# Altium project ONLY_power_board.PrjPcb
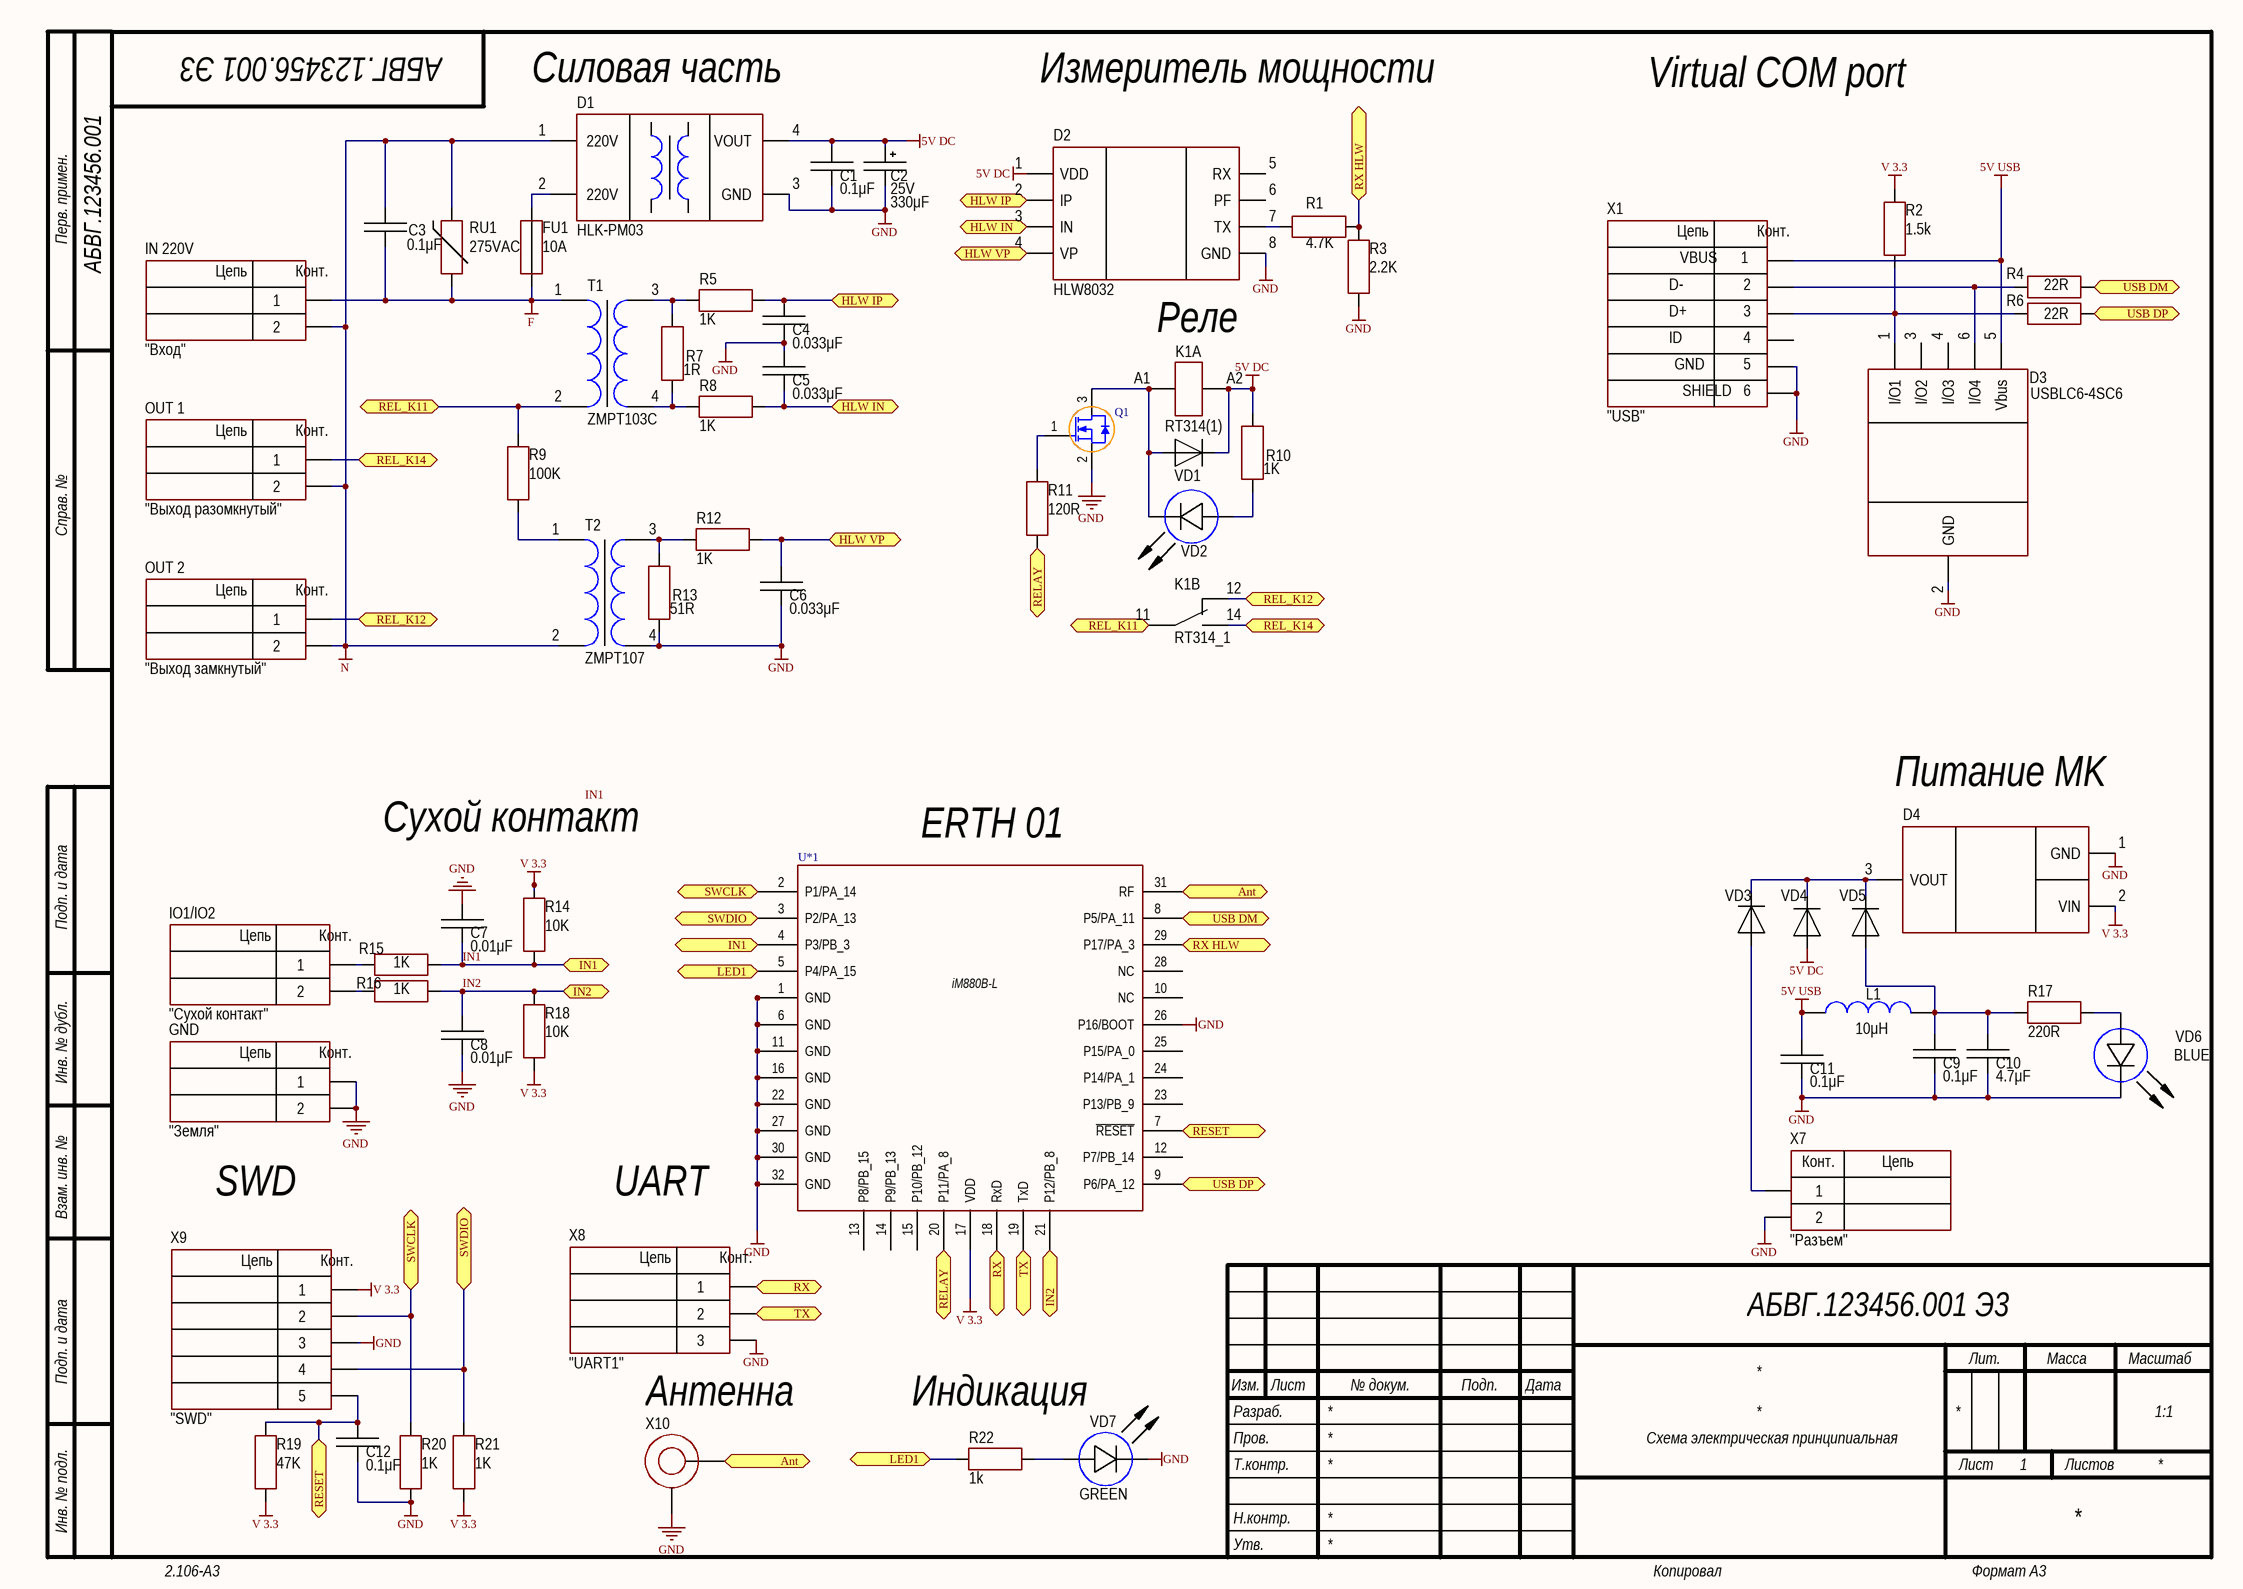
[diagram p0: Power1.SchDoc]
1 sheet, 63 parts. Net scope: flat (ports and power ports of the same name join across sheets).
Board file: Power.PcbDoc

## Sheet Power1.SchDoc
size 420 x 297 mm; Address1: Address1; Address2: Address2; Address3: Address3; Address4: Address4; DocumentNumber: АБВГ.123456.001 Э3; SheetNumber: 1; Scale: 1:1; DocumentType: Схема электрическая принципиальная; FirstReferrence: АБВГ.123456.001

### Parts
C1  value 0.1μF  [CAP: 0805]
C2  value 330μF  Voltage: 25V  [CAP: D13C5H25]
C3  value 0.1μF  [CAP: B32521]  (hidden comment: 400V)
C4  value 0.033μF  [CAP: 0805]
C5  value 0.033μF  [CAP: 0805]
C6  value 0.033μF  [CAP: 0805]
C7  value 0.01μF  [CAP: 0805]
C8  value 0.01μF  [CAP: 0805]
C9  value 0.1μF  [CAP: 0805]
C10  value 4.7μF  [CAP: 0805]
C11  value 0.1μF  [CAP: 0805]
C12  value 0.1μF  [CAP: 0805]
D1  (no value)  [MOD: HLK-PM01]
D2  (no value)  [8-SOP-8_1_27]
D3  PartNumber: USBLC6-4SC6  [SOT23-6]
D4  (no value)  [SOT23-5]
FU1  MaxCurrent: 10A  [FUSE: FH-100 (5x20 mm)]
GND  CommentText: "Земля"  [393570002]
IN_220V  CommentText: "Вход"  [393570002]
IO1/IO2  CommentText: "Сухой контакт"  [393570002]
K1  PartNumber: RT314(1)  [REL: RT314005]  (parts A,B of 3)
L1  value 10μH  [IND: 0805]
OUT_1  CommentText: "Выход разомкнутый"  [393570002]
OUT_2  CommentText: "Выход замкнутый"  [393570002]
Q1  TRPBF  [SOT23_N+]  (value not drawn)
R1  value 4.7K  [RES: 0805]
R2  value 1.5k  [RES: 0805]
R3  value 2.2K  [RES: 0805]
R4  value 22R  [RES: 0805]
R5  value 1K  [RES: 0805]
R6  value 22R  [RES: 0805]
R7  value 1R  [RES: 0805]
R8  value 1K  [RES: 0805]
R9  value 100K  [RES: 1206]
R10  value 1K  [RES: 0805]
R11  value 120R  [RES: 0805]
R12  value 1K  [RES: 0805]
R13  value 51R  [RES: 0805]
R14  value 10K  [RES: 0805]
R15  value 1K  [RES: 0805]
R16  value 1K  [RES: 0805]
R17  value 220R  [RES: 0805]
R18  value 10K  [RES: 0805]
R19  value 47K  [RES: 0805]
R20  value 1K  [RES: 0805]
R21  value 1K  [RES: 0805]
R22  value 1k  [RES: 0805]
RU1  MaxVoltage: 275VAC  [CAP: B32521]
T1  Voltage: ZMPT103C  [TRANS:ZMCT103C]
T2  Voltage: ZMPT107  [TRANS:ZMPT107-1]
U*1  iM880B-L  [iM880B]
VD1  C2128  [DIODE: SOD123F]  (value not drawn)
VD2  (no value)  [LED: 0805R]
VD3  C2128  [DIODE: SOD123F]  (value not drawn)
VD4  C2128  [DIODE: SOD123F]  (value not drawn)
VD5  C2128  [DIODE: SOD123F]  (value not drawn)
VD6  Color: BLUE  [LED: 0805B]
VD7  Color: GREEN  [LED: 0805G]
X1  CommentText: "USB"  [CON: USB micro-A (ZX62-B-5PA)]
X7  CommentText: "Разъем"  [CON: B2B-EH-A]
X8  CommentText: "UART1"  [CON: PLS-3]
X9  CommentText: "SWD"  [CON: PLS-5]
X10  (no value)  [CON: u.Fl]

### Ports
Ant, HLW IN, HLW IP, HLW VP, IN1, IN2, LED1, REL_K11, REL_K12, REL_K14, RELAY, RESET, RX, RX HLW, SWCLK, SWDIO, TX, USB DM, USB DP

### Nets
5V DC: C1.2 C2.1 D1.4(VOUT) D2.1(VDD) K1.A2 R10.2 VD1.2 VD4.1
5V USB: C11.2 D3.5(Vbus) L1.2 X1.1
F: C3.1 FU1.1 IN_220V.1 RU1.1 T1.1
GND: C1.1 C2.2 C4.1 C5.2 C6.1 C7.2 C8.1 C9.1 C10.1 C11.1 C12.1 D1.3(GND) D2.8(GND) D3.2(GND) D4.1(GND) GND.1 GND.2 Q1.2(S) R3.2 R13.1 R20.2 T2.4 U*1.1(GND) U*1.6(GND) U*1.11(GND) U*1.16(GND) U*1.22(GND) U*1.26(P16/BOOT) U*1.27(GND) U*1.30(GND) U*1.32(GND) VD6.2(C) VD7.2(C) X1.0 X1.5 X7.2 X8.3 X9.3 X10.2
N: C3.2 D1.1(220V) IN_220V.2 OUT_1.2 OUT_2.2 RU1.2 T2.2
V 3.3: D4.2(VIN) R2.2 R14.1 R18.1 R19.2 R21.2 U*1.17(VDD) X9.1
IN1: C7.1 R14.2 R15.1 U*1.4(P3/PB_3) ; port IN1
IN2: C8.2 R16.1 R18.2 U*1.21(P12/PB_8) ; port IN2
NetC4_2: C4.2 D2.2(IP) R5.1 ; port HLW IP
NetC5_1: C5.1 D2.3(IN) R8.1 ; port HLW IN
NetC6_2: C6.2 D2.4(VP) R12.1 ; port HLW VP
NetC9_2: C9.2 C10.2 L1.1 R17.2 VD5.1
NetC12_2: C12.2 R19.1 U*1.7(~{RESET}) X9.5 ; port RESET
NetD1_2: D1.2(220V) FU1.2
NetD2_7: D2.7(TX) R1.1
NetD3_1: D3.1(I/O1) R2.1 R6.1 X1.3
NetD3_6: D3.6(I/O4) R4.1 X1.2
NetD4_3: D4.3(VOUT) VD3.2 VD4.2 VD5.2
NetIO1/IO2_1: IO1/IO2.1 R15.2
NetIO1/IO2_2: IO1/IO2.2 R16.2
NetK1_11: K1.11 R9.2 T1.2 ; port REL_K11
NetK1_12: K1.12 OUT_2.1 ; port REL_K12
NetK1_14: K1.14 OUT_1.1 ; port REL_K14
NetK1_A1: K1.A1 Q1.3(D) VD1.1 VD2.2(C)
NetQ1_1: Q1.1(G) R11.1
NetR1_2: R1.2 R3.1 U*1.29(P17/PA_3) ; port RX HLW
NetR4_2: R4.2 U*1.8(P5/PA_11) ; port USB DM
NetR5_2: R5.2 R7.2 T1.3
NetR6_2: R6.2 U*1.9(P6/PA_12) ; port USB DP
NetR7_1: R7.1 R8.2 T1.4
NetR9_1: R9.1 T2.1
NetR10_1: R10.1 VD2.1(A)
NetR11_2: R11.2 U*1.20(P11/PA_8) ; port RELAY
NetR12_2: R12.2 R13.2 T2.3
NetR17_1: R17.1 VD6.1(A)
NetR20_1: R20.1 U*1.2(P1/PA_14) X9.2 ; port SWCLK
NetR21_1: R21.1 U*1.3(P2/PA_13) X9.4 ; port SWDIO
NetR22_1: R22.1 VD7.1(A)
NetR22_2: R22.2 U*1.5(P4/PA_15) ; port LED1
NetU*1_18: U*1.18(RxD) X8.1 ; port RX
NetU*1_19: U*1.19(TxD) X8.2 ; port TX
NetU*1_31: U*1.31(RF) X10.1 ; port Ant
NetVD3_1: VD3.1 X7.1

Not connected (* = marked no-connect by the designer): D2 5(RX) 6(PF); D3 3(I/O2) 4(I/O3); U*1 10(NC) 12(P7/PB_14) 13(P8/PB_15) 14(P9/PB_13) 15(P10/PB_12) 23(P13/PB_9) 24(P14/PA_1) 25(P15/PA_0) 28(NC); X1 4

### Notes on the sheet
- Силовая часть
- Измеритель мощности
- Virtual COM port
- Реле
- Питание MK
- Cухой контакт
- (near U*1) ERTH 01
- SWD
- UART
- Антенна
- Индикация
- Labels drawn without touching a wire or pin: IN1
- Перв. примен.
- Справ. №
- Подп. и дата
- Инв. № дубл.
- Взам. инв. №
- Разраб.
- Изм.
- Лист
- № докум.
- Подп.
- Дата
- Лит.
- Масса
- Масштаб
- Пров.
- Т.контр.
- Листов
- Инв. № подл.
- Утв.
- Н.контр.
- 2.106-A3
- Копировал
- Формат А3
- (in symbol Connector-Wago 734-102/037-000) Цепь; Конт.
- (in symbol Connector_B2B-EH-A) Конт.; Цепь
- (in symbol Connector_USB_micro_B) Цепь; Конт.; VBUS; D-; D+; ID; GND; SHIELD; 6
- (in symbol PLS-3) Цепь; Конт.
- (in symbol PLS-5) Цепь; Конт.

### Library data of the parts
C1 C3 C9 C11 C12 = Ceramic_0805: Manufacturer: Yageo; PartNumber: C49678; TypeCapacitor: Ceramic capacitor; Tolerance: ±10%; TypeDielectric: X7R; HelpURL: https://www.digikey.com/product-detail/en/yageo/CC0805KRX7R7BB104/311-1142-1-ND/303052; ValueManufacturerPartNumber: =TypeCapacitor+', '+Value+', '+TypeDielectric+', '+Tolerance+', '+Voltage+', '+Package+', '+Temperature; Temperature: -55...+125°C
  C1 C9 C11 C12: Package: 0805
  C3: Package: DIP
C2 = Aluminium: Manufacturer: Wurth; PartNumber: 860080475013; ValueManufacturerPartNumber: Aluminium capacitor, 330μF, 25V, ±20%, 54mOhm, 14x10x5 mm, -55...+105°C; TypeCapacitor: Aluminium capacitor; Tolerance: ±20%; Impedance: 54mOhm; Package: 14x10x5 mm; HelpURL: https://www.digikey.com/product-detail/en/wurth-electronics-inc/860080475013/732-9029-1-ND/5728972; Temperature: -55...+105°C
C4-C6 = Ceramic_0805: Manufacturer: Yageo; PartNumber: C1739; TypeCapacitor: Ceramic capacitor; Tolerance: ±10%; TypeDielectric: X7R; Package: 0805; HelpURL: https://www.digikey.com/product-detail/en/yageo/CC0805KRX7R7BB104/311-1142-1-ND/303052; ValueManufacturerPartNumber: =TypeCapacitor+', '+Value+', '+TypeDielectric+', '+Tolerance+', '+Voltage+', '+Package+', '+Temperature; Temperature: -55...+125°C
C7 C8 = Ceramic_0805: Manufacturer: Yageo; PartNumber: C1710; TypeCapacitor: Ceramic capacitor; Tolerance: ±10%; TypeDielectric: X7R; Package: 0805; HelpURL: https://www.digikey.com/product-detail/en/yageo/CC0805KRX7R7BB104/311-1142-1-ND/303052; ValueManufacturerPartNumber: =TypeCapacitor+', '+Value+', '+TypeDielectric+', '+Tolerance+', '+Voltage+', '+Package+', '+Temperature; Temperature: -55...+125°C
C10 = Ceramic_0805: Manufacturer: Yageo; PartNumber: C1779; TypeCapacitor: Ceramic capacitor; Tolerance: ±10%; TypeDielectric: X7R; Package: 0805; HelpURL: https://www.digikey.com/product-detail/en/yageo/CC0805KRX7R7BB104/311-1142-1-ND/303052; ValueManufacturerPartNumber: =TypeCapacitor+', '+Value+', '+TypeDielectric+', '+Tolerance+', '+Voltage+', '+Package+', '+Temperature; Temperature: -55...+125°C
D1 = HLK-PM03: AC/DC converter; Manufacturer: Mornsun; ValueManufacturerPartNumber: AC/DC converter, isolator, 3V 900mA, 100...240VAC, -40...+105°C, 30x20x15mm; OutputType: isolator; OutputVoltage: 3V 900mA; InputVoltage: 100...240VAC; HelpURL: https://ru.aliexpress.com/item/32408565688.html; Package: 30x20x15mm; ComponentType: AC/DC converter; Temperature: -40...+105°C; PartNumber: HLK-PM03
D2 = HLW8032: ADC; Manufacturer: Asia; ValueManufacturerPartNumber: IC ADC, 24 bit, 4800 9N1, UART, 5V, -40...+125°C, SOP-8; Supply: 5V; Speed: 4800 9N1; InterfaceData: UART; Resolution: 24 bit; HelpURL: https://www.digikey.com/product-detail/en/microchip-technology/MCP3221A5T-I-OT/MCP3221A5T-I-OTCT-ND/529836; Package: SOP-8; ComponentType: IC ADC; Temperature: -40...+125°C; PartNumberLCSC: C128023; PartNumber: HLW8032
D3 = ISOUSBLC6-4SC6: USB Isolator; Manufacturer: Texas Instruments; ValueManufacturerPartNumber: IC USB isolator, 1Mbps, Half-duplex, 3...5.5V, -55...+105°C, SOT-23-6; Supply: 3...5.5V; DataRate: 1Mbps; TypeDuplex: Half-duplex; HelpURL: https://www.chipdip.ru/product/usblc6-4sc6; Package: SOT-23-6; ComponentType: IC USB isolator; Temperature: -55...+105°C
D4 = TTLV70436DBVT: Linear voltage regulator; Manufacturer: Texas Instruments; ValueManufacturerPartNumber: Linear voltage regulator, input 5.5V, 0.25V, output 3.3V, 200 mA, -40...+85°C, SOT-23-5; PartNumber: C133625; VoltageInput: input 5.5V; MaxDropout: 0.25V; CurrentOutput: 200 mA; VoltageOutput: output 3.3V; HelpURL: https://www.digikey.com/product-detail/en/texas-instruments/TLV70033DDCR/296-27937-1-ND/2440840; Package: SOT-23-5; ComponentType: Linear voltage regulator; Temperature: -40...+85°C
FU1 = Fuse: Manufacturer: Littelfuse; PartNumber: 01110501Z; TypeFuse: Electromechanics relay; VoltageMax: 250VAC; Package: 5x20mm; HelpURL: https://www.digikey.com/products/en?keywords=01110501Z; ValueManufacturerPartNumber: =TypeFuse+', '+VoltageMax+', '+MaxCurrent+', '+Package+', '+Temperature
GND IO1/IO2 OUT_1 OUT_2 = Connector-Wago 734-102/037-000: Manufacturer: Wago; ValueManufacturerPartNumber: Connector, 2pin, 10mm, 1000V, 20A; VoltageMax: 1000V; Pitch: 10mm; CurrentMax: 20A; Multichannel: 2pin; HelpURL: https://www.wago.com/ru/%D1%81%D1%8A%D0%B5%D0%BC%D0%BD%D1%8B%D0%B5-%D1%81%D0%BE%D0%B5%D0%B4%D0%B8%D0%BD%D0%B8%D1%82%D0%B5%D0%BB%D0%B8-%D0%B8-%D0%BA%D0%BB%D0%B5%D0%BC%D0%BC%D1%8B-%D0%B4%D0%BB%D1%8F-%D0%BF%D0%B5%D1%87%D0%B0%D1%82%D0%BD%D1%8B%D1%85-%D0%BF%D0%BB%D0%B0%D1%82/%D0%BA%D0%BB%D0%B5%D0%BC%D0%BC%D0%B0-%D0%BD%D0%B0-%D0%BF%D0%B5%D1%87%D0%B0%D1%82%D0%BD%D1%83%D1%8E-%D0%BF%D0%BB%D0%B0%D1%82%D1%83/p/739-3202; TypeConnector: Connector; PartNumber: 734-102/037-000
IN_220V = Connector-Wago 734-102/037-000: ValueManufacturerPartNumber: Connector, 2pin, 10mm, 1000V, 20A; VoltageMax: 1000V; Pitch: 10mm; CurrentMax: 20A; Multichannel: 2pin; Manufacturer: 393570002; HelpURL: https://www.wago.com/ru/%D1%81%D1%8A%D0%B5%D0%BC%D0%BD%D1%8B%D0%B5-%D1%81%D0%BE%D0%B5%D0%B4%D0%B8%D0%BD%D0%B8%D1%82%D0%B5%D0%BB%D0%B8-%D0%B8-%D0%BA%D0%BB%D0%B5%D0%BC%D0%BC%D1%8B-%D0%B4%D0%BB%D1%8F-%D0%BF%D0%B5%D1%87%D0%B0%D1%82%D0%BD%D1%8B%D1%85-%D0%BF%D0%BB%D0%B0%D1%82/%D0%BA%D0%BB%D0%B5%D0%BC%D0%BC%D0%B0-%D0%BD%D0%B0-%D0%BF%D0%B5%D1%87%D0%B0%D1%82%D0%BD%D1%83%D1%8E-%D0%BF%D0%BB%D0%B0%D1%82%D1%83/p/739-3202; TypeConnector: Connector; PartNumber: 734-102/037-000
K1 = RT314005: Manufacturer: TE; ValueManufacturerPartNumber: Electromechanics relay, 3VDC, 250VAC, 16A, 2NO+2NC, -40...+85°C; TypeRelay: Electromechanics relay; VoltageMax: 250VAC; VoltageControlCoil: 3VDC; MaxCurrent: 16A; Package: 2NO+2NC; HelpURL: https://www.chipdip.ru/product/9-1393239-1-rt314005; Temperature: -40...+85°C
L1 = Inductor_0805: Manufacturer: Murata Electronics; PartNumber: C1015; TypeInductor: Fixed inductor; MaxCurrent: 100mA; Package: 0805; HelpURL: https://www.digikey.com/product-detail/en/murata-electronics-north-america/LQM21FN100M70L/490-4029-1-ND/1016289; ValueManufacturerPartNumber: =TypeInductor+', '+Value+', '+Tolerance+', '+Package+', '+MaxCurrent+', '+Temperature; Temperature: -55...+125°C
Q1 = IRLML2402TRPBF++: PartNumber: C20917; Manufacturer: DiodesIncorporated; Package Reference: SOT-23
R1 = Resistor_0805: Manufacturer: Yageo; PartNumber: C17673; TypeResistor: Resistor film; Power: 0.125W; Package: 0805; HelpURL: https://www.digikey.com/product-detail/en/yageo/RC0805JR-07100RL/311-100ARCT-ND/731185; ValueManufacturerPartNumber: =TypeResistor+', '+Value+', '+Tolerance+', '+Package+', '+Power+', '+Temperature; Temperature: -55...+125°C
R2 = Resistor_0805: Manufacturer: Yageo; PartNumber: C4310; TypeResistor: Resistor film; Power: 0.125W; Package: 0805; HelpURL: https://www.digikey.com/product-detail/en/yageo/RC0805JR-07100RL/311-100ARCT-ND/731185; ValueManufacturerPartNumber: =TypeResistor+', '+Value+', '+Tolerance+', '+Package+', '+Power+', '+Temperature; Temperature: -55...+125°C
R3 = Resistor_0805: Manufacturer: Yageo; PartNumber: C17520; TypeResistor: Resistor film; Power: 0.125W; Package: 0805; HelpURL: https://www.digikey.com/product-detail/en/yageo/RC0805JR-07100RL/311-100ARCT-ND/731185; ValueManufacturerPartNumber: =TypeResistor+', '+Value+', '+Tolerance+', '+Package+', '+Power+', '+Temperature; Temperature: -55...+125°C
R4 R6 = Resistor_0805: Manufacturer: Yageo; PartNumber: C17561; TypeResistor: Resistor film; Power: 0.125W; Package: 0805; HelpURL: https://www.digikey.com/product-detail/en/yageo/RC0805JR-07100RL/311-100ARCT-ND/731185; ValueManufacturerPartNumber: =TypeResistor+', '+Value+', '+Tolerance+', '+Package+', '+Power+', '+Temperature; Temperature: -55...+125°C
R5 R8 R10 R12 R15 R16 R20-R22 = Resistor_0805: Manufacturer: Yageo; PartNumber: C17513; TypeResistor: Resistor film; Power: 0.125W; Package: 0805; HelpURL: https://www.digikey.com/product-detail/en/yageo/RC0805JR-07100RL/311-100ARCT-ND/731185; ValueManufacturerPartNumber: =TypeResistor+', '+Value+', '+Tolerance+', '+Package+', '+Power+', '+Temperature; Temperature: -55...+125°C
R7 = Resistor_0805: Manufacturer: Yageo; PartNumber: C25271; TypeResistor: Resistor film; Power: 0.125W; Package: 0805; HelpURL: https://www.digikey.com/product-detail/en/yageo/RC0805JR-07100RL/311-100ARCT-ND/731185; ValueManufacturerPartNumber: =TypeResistor+', '+Value+', '+Tolerance+', '+Package+', '+Power+', '+Temperature; Temperature: -55...+125°C
R9 = Resistor_0805: PartNumber: C17900; TypeResistor: Resistor film; Power: 0.125W; Package: 0805; HelpURL: https://jlcpcb.com/parts/componentSearch?secondSortUuid=a49341812cad4b0bafa2ddd547a82bd4&name=Chip%20Resistor%20-%20Surface%20Mount&firstSortUuid=b97df1fd049743c0a0330513eac35a72; ValueManufacturerPartNumber: =TypeResistor+', '+Value+', '+Tolerance+', '+Package+', '+Power+', '+Temperature; Temperature: -55...+125°C
R11 = Resistor_0805: Manufacturer: Yageo; PartNumber: C17437; TypeResistor: Resistor film; Power: 0.125W; Package: 0805; HelpURL: https://www.digikey.com/product-detail/en/yageo/RC0805JR-07100RL/311-100ARCT-ND/731185; ValueManufacturerPartNumber: =TypeResistor+', '+Value+', '+Tolerance+', '+Package+', '+Power+', '+Temperature; Temperature: -55...+125°C
R13 = Resistor_0805: Manufacturer: Yageo; PartNumber: C17738; TypeResistor: Resistor film; Power: 0.125W; Package: 0805; HelpURL: https://www.digikey.com/product-detail/en/yageo/RC0805JR-07100RL/311-100ARCT-ND/731185; ValueManufacturerPartNumber: =TypeResistor+', '+Value+', '+Tolerance+', '+Package+', '+Power+', '+Temperature; Temperature: -55...+125°C
R14 R18 = Resistor_0805: Manufacturer: Yageo; PartNumber: C17414; TypeResistor: Resistor film; Power: 0.125W; Package: 0805; HelpURL: https://www.digikey.com/product-detail/en/yageo/RC0805JR-07100RL/311-100ARCT-ND/731185; ValueManufacturerPartNumber: =TypeResistor+', '+Value+', '+Tolerance+', '+Package+', '+Power+', '+Temperature; Temperature: -55...+125°C
R17 = Resistor_0805: Manufacturer: Yageo; PartNumber: C17557; TypeResistor: Resistor film; Power: 0.125W; Package: 0805; HelpURL: https://www.digikey.com/product-detail/en/yageo/RC0805JR-07100RL/311-100ARCT-ND/731185; ValueManufacturerPartNumber: =TypeResistor+', '+Value+', '+Tolerance+', '+Package+', '+Power+', '+Temperature; Temperature: -55...+125°C
R19 = Resistor_0805: Manufacturer: Yageo; PartNumber: C17713; TypeResistor: Resistor film; Power: 0.125W; Package: 0805; HelpURL: https://www.digikey.com/product-detail/en/yageo/RC0805JR-07100RL/311-100ARCT-ND/731185; ValueManufacturerPartNumber: =TypeResistor+', '+Value+', '+Tolerance+', '+Package+', '+Power+', '+Temperature; Temperature: -55...+125°C
RU1 = Varistor: Manufacturer: Bourns; PartNumber: MOV-07D431KTR; ValueManufacturerPartNumber: Varistor, 275VAC, pitch 7mm, -55...+125°C; Package: pitch 7mm; HelpURL: https://www.digikey.com/product-detail/en/bourns-inc/MOV-07D431KTR/MOV-07D431KTRCT-ND/4318145; Temperature: -55...+125°C; TypeResistor: Varistor
T1 = Currient_ZMPT103C: Manufacturer: Hahn Trafo; ValueManufacturerPartNumber: Transformer, ZMPT103C, 0.35W; PartNumber: ZMPT107-1; TypeTransformer: Transformer; Power: 0.35W; HelpURL: https://www.electronshik.ru/item/HAHN/BVhttps://lcsc.com/product-detail/Current-Transformers_Qingxian-Zeming-Langxi-Elec-ZMPT107_C94572.html20201%200128; PartNumberLCSC: C94572
T2 = Voltage_ZMPT107-1: Manufacturer: Hahn Trafo; ValueManufacturerPartNumber: Transformer, ZMPT107, 0.35W; TypeTransformer: Transformer; Power: 0.35W; HelpURL: https://www.electronshik.ru/item/HAHN/BVhttps://lcsc.com/product-detail/Current-Transformers_Qingxian-Zeming-Langxi-Elec-ZMPT107_C94572.html20201%200128; PartNumber: ZMPT107-1; PartNumberLCSC: C94572
U*1 = iM880B-L: Manufacture: IMST
VD1 VD3-VD5 = Diode_single: Manufacturer: Micro Commercial; TypeDiode: Single diode; Voltage: 75V; Current: 150mA; VoltageDrop: 1V; RecoveryTime: 4ns; Package: SOD-323; HelpURL: https://www.digikey.com/product-detail/en/micro-commercial-co/1N4148WX-TP/1N4148WXTPMSCT-ND/717312; ValueManufacturerPartNumber: C2128; Temperature: -55...+150°C
VD2 = LED_single: ValueManufacturerPartNumber: LED, Green, *, *, *, -55...+150°C; PartNumber: C84256; TypeDiode: LED; ColorParameter: Green; Manufacturer: *; Package: *; HelpURL: *; Temperature: -55...+150°C; Current: *; VoltageDrop: *
VD6 = LED_single: ValueManufacturerPartNumber: LED, Green, *, *, *, -55...+150°C; PartNumber: C34499; TypeDiode: LED; ColorParameter: Green; Manufacturer: *; Package: *; HelpURL: *; Temperature: -55...+150°C; Current: *; VoltageDrop: *
VD7 = LED_single: ValueManufacturerPartNumber: LED, Green, *, *, *, -55...+150°C; PartNumber: C2296; TypeDiode: LED; Manufacturer: *; Package: *; HelpURL: *; Temperature: -55...+150°C; Current: *; VoltageDrop: *; ColorParameter: Green
X1 = Connector_USB_micro_B: Manufacturer: Hirose Electric; ValueManufacturerPartNumber: USB micro B; PartNumber: ZX62-B-5PA; HelpURL: https://www.digikey.com/product-detail/en/hirose-electric-co-ltd/ZX62-B-5PA/H11579CT-ND/1851090; TypeConnector: USB micro B
X7 = Connector_B2B-EH-A: Manufacturer: JST; ValueManufacturerPartNumber: Connector, 2pin, 2.5 mm, 250V, 3A; VoltageMax: 250V; Pitch: 2.5 mm; CurrentMax: 3A; Multichannel: 2pin; HelpURL: https://www.digikey.com/product-detail/en/jst-sales-america-inc/B2B-EH-A-LF-SN/455-1611-ND/926520; TypeConnector: Connector; PartNumber: B2B-EH-A
X8 = PLS-3: Manufacturer: Connfly; ValueManufacturerPartNumber: Connector, 3pin, 2.54mm, 500VAC, 3A; TypeConnector: Connector; VoltageMax: 500VAC; Pitch: 2.54mm; CurrentMax: 3A; Multichannel: 3pin; HelpURL: https://www.chipdip.ru/product/pls-3; PartNumber: PLS-3
X9 = PLS-5: Manufacturer: Connfly; ValueManufacturerPartNumber: Connector, 5pin, 2.54mm, 500VAC, 3A; TypeConnector: Connector; VoltageMax: 500VAC; Pitch: 2.54mm; CurrentMax: 3A; Multichannel: 5pin; HelpURL: https://www.chipdip.ru/product/pls-5; PartNumber: PLS-5
X10 = Connector_uFL: Manufacturer: Hirose Electric; ValueManufacturerPartNumber: Connector u.FL, 50 Ohm, 6GHz; PartNumber: U.FL-R-SMT(01); TypeConnector: Connector u.FL; Frequency: 6GHz; Impedance: 50 Ohm; HelpURL: https://www.digikey.com/product-detail/en/hirose-electric-co-ltd/U.FL-R-SMT-01/H9161-ND/513010